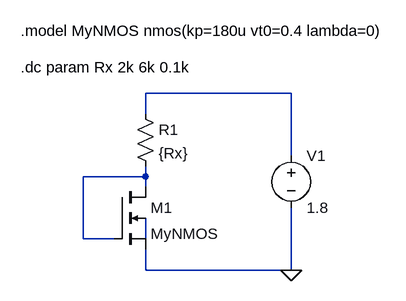
[diagram p0: schematic How to Sweep a Parameter in LTspice.asc]
How to Sweep a Parameter in LTspice.asc, the LTspice schematic file:
Version 4
SHEET 1 880 680
WIRE 384 16 160 16
WIRE 160 48 160 16
WIRE 384 112 384 16
WIRE 160 144 160 128
WIRE 160 144 64 144
WIRE 160 160 160 144
WIRE 64 240 64 144
WIRE 112 240 64 240
WIRE 160 240 160 208
WIRE 160 288 160 256
WIRE 384 288 384 192
WIRE 384 288 160 288
FLAG 384 288 0
SYMBOL nmos4 112 160 R0
SYMATTR InstName M1
SYMATTR Value MyNMOS
SYMATTR Value2 l=1u w=25u
SYMBOL res 144 32 R0
SYMATTR InstName R1
SYMATTR Value {Rx}
SYMBOL voltage 384 96 R0
WINDOW 123 0 0 Left 0
WINDOW 39 0 0 Left 0
SYMATTR InstName V1
SYMATTR Value 1.8
TEXT -32 -80 Left 2 !.model MyNMOS nmos(kp=180u vt0=0.4 lambda=0)
TEXT -32 -24 Left 2 !.dc param Rx 2k 6k 0.1k

The netlist it stands for:
* How to Sweep a Parameter in LTspice.asc
M1 N002 N002 0 N003 MyNMOS l=1u w=25u
R1 N001 N002 {Rx}
V1 N001 0 1.8
.model NMOS NMOS
.model PMOS PMOS
.lib standard.mos
.model MyNMOS nmos(kp=180u vt0=0.4 lambda=0)
.dc param Rx 2k 6k 0.1k
.backanno
.end